# EAGLE design MOSFET Board (EAGLE 8.6.1)
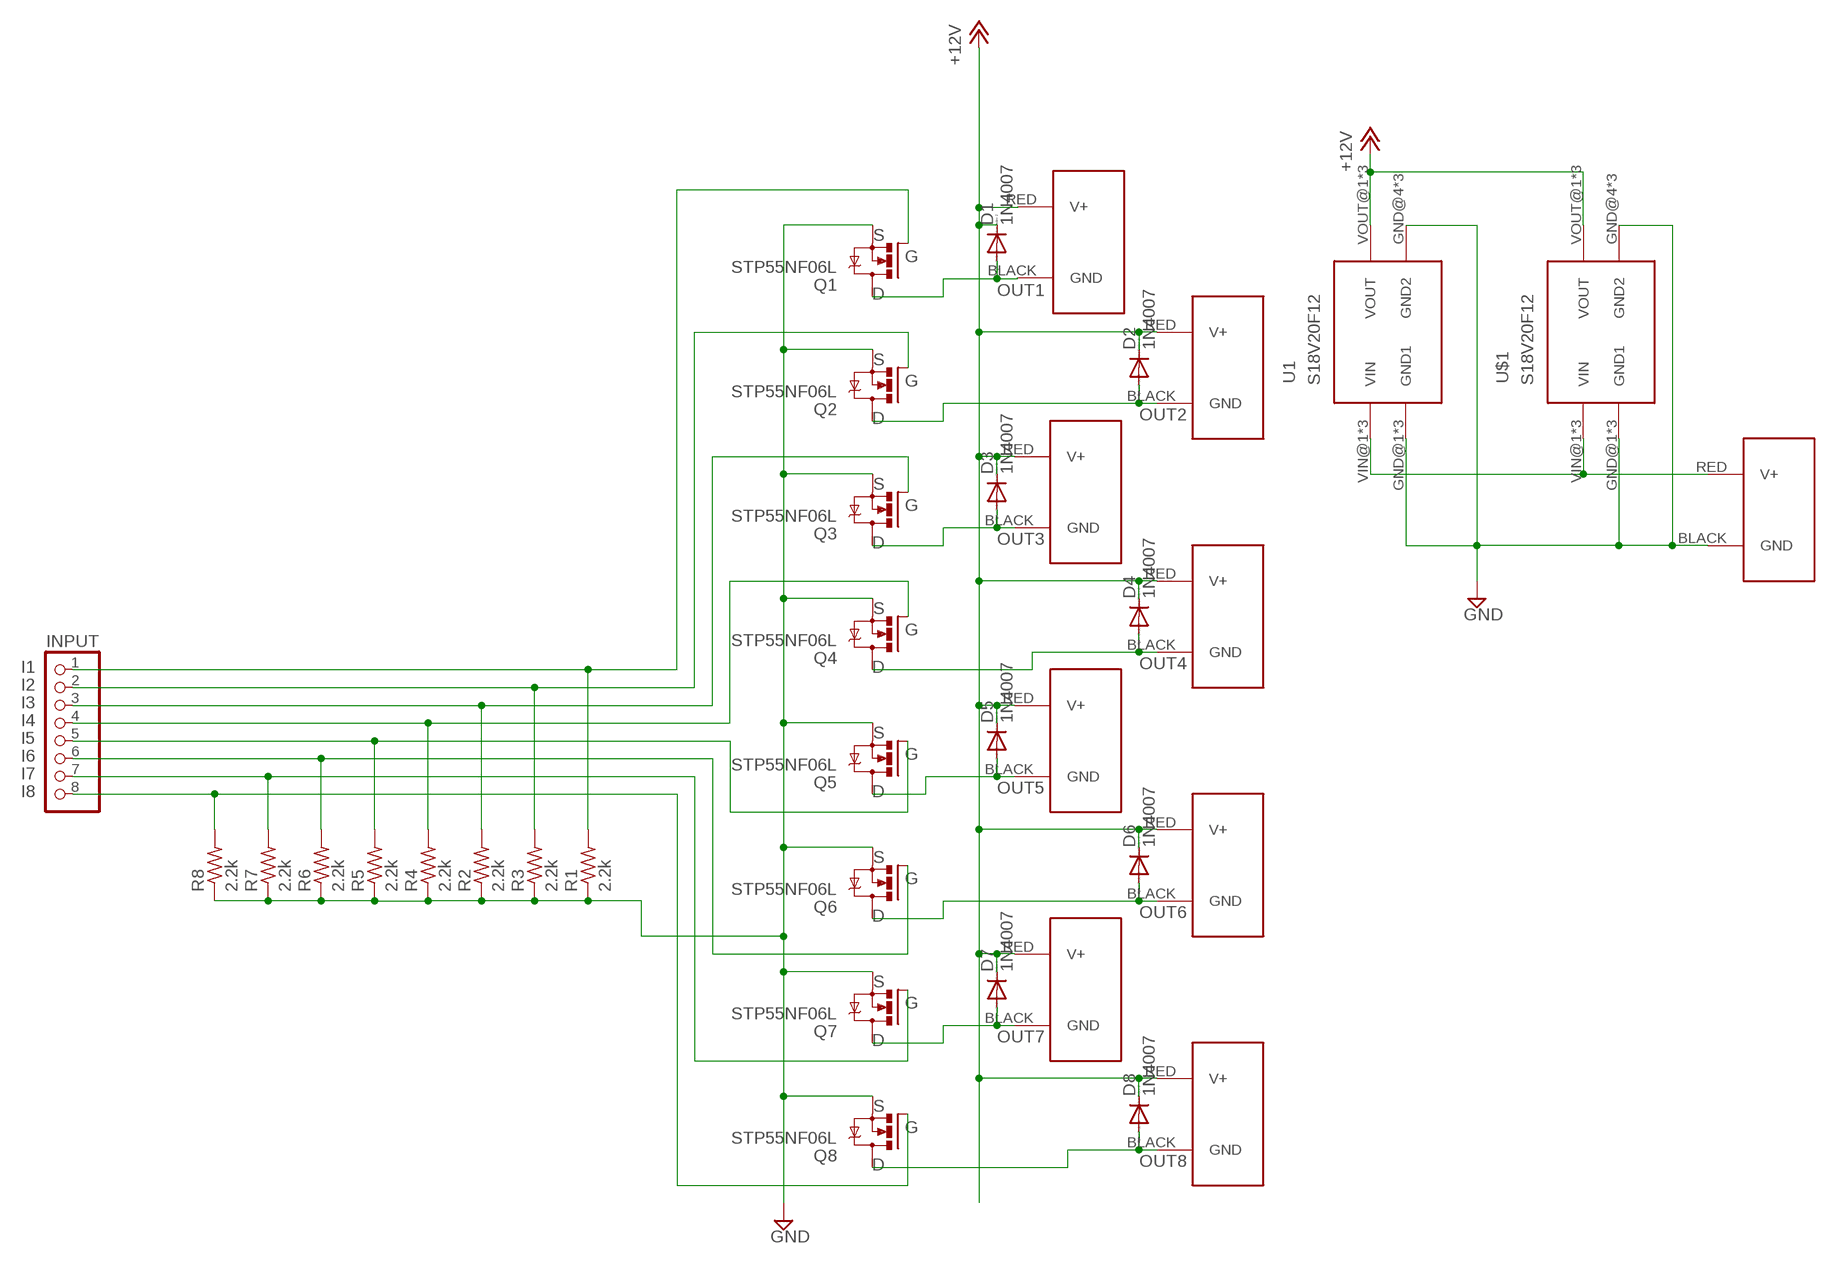
[diagram p0: schematic, sheet 1]

## Parts
D1  1N4007  [DO41-10]
D2  1N4007  [DO41-10]
D3  1N4007  [DO41-10]
D4  1N4007  [DO41-10]
D5  1N4007  [DO41-10]
D6  1N4007  [DO41-10]
D7  1N4007  [DO41-10]
D8  1N4007  [DO41-10]
INPUT  PINHD-1X8  [1X08]
J1  POWERPOLE_POWER25A  [POWERPOLE_PAIR_25A]
J2  POWERPOLE_POWER25A  [POWERPOLE_PAIR_25A]
J3  POWERPOLE_POWER25A  [POWERPOLE_PAIR_25A]
J4  POWERPOLE_POWER25A  [POWERPOLE_PAIR_25A]
J5  POWERPOLE_POWER25A  [POWERPOLE_PAIR_25A]
J6  POWERPOLE_POWER25A  [POWERPOLE_PAIR_25A]
J7  POWERPOLE_POWER25A  [POWERPOLE_PAIR_25A]
J8  POWERPOLE_POWER25A  [POWERPOLE_PAIR_25A]
J9  POWERPOLE_POWER25A  [POWERPOLE_PAIR_25A]
Q1  STP55NF06L  [TO220-3]
Q2  STP55NF06L  [TO220-3]
Q3  STP55NF06L  [TO220-3]
Q4  STP55NF06L  [TO220-3]
Q5  STP55NF06L  [TO220-3]
Q6  STP55NF06L  [TO220-3]
Q7  STP55NF06L  [TO220-3]
Q8  STP55NF06L  [TO220-3]
R1  2.2k  R-US_0207/10  [0207/10]
R2  2.2k  R-US_0207/10  [0207/10]
R3  2.2k  R-US_0207/10  [0207/10]
R4  2.2k  R-US_0207/10  [0207/10]
R5  2.2k  R-US_0207/10  [0207/10]
R6  2.2k  R-US_0207/10  [0207/10]
R7  2.2k  R-US_0207/10  [0207/10]
R8  2.2k  R-US_0207/10  [0207/10]
U1  S18V20F12  [S18V20]
U$1  S18V20F12  [S18V20]

## Nets
+12V: D1.C D2.C D3.C D4.C D5.C D6.C D7.C D8.C J2.RED(V+) J3.RED(V+) J4.RED(V+) J5.RED(V+) J6.RED(V+) J7.RED(V+) J8.RED(V+) J9.RED(V+) U1.VOUT@1(VOUT) U1.VOUT@2(VOUT) U1.VOUT@3(VOUT) U$1.VOUT@1(VOUT) U$1.VOUT@2(VOUT) U$1.VOUT@3(VOUT)
GND: J1.BLACK(GND) Q1.S Q2.S Q3.S Q4.S Q5.S Q6.S Q7.S Q8.S R1.1 R2.1 R3.1 R4.1 R5.1 R6.1 R7.1 R8.1 U1.GND@1(GND1) U1.GND@2(GND1) U1.GND@3(GND1) U1.GND@4(GND2) U1.GND@5(GND2) U1.GND@6(GND2) U$1.GND@1(GND1) U$1.GND@2(GND1) U$1.GND@3(GND1) U$1.GND@4(GND2) U$1.GND@5(GND2) U$1.GND@6(GND2)
I1: INPUT.1 Q1.G R1.2
I2: INPUT.2 Q2.G R3.2
I3: INPUT.3 Q3.G R2.2
I4: INPUT.4 Q4.G R4.2
I5: INPUT.5 Q5.G R5.2
I6: INPUT.6 Q6.G R6.2
I7: INPUT.7 Q7.G R7.2
I8: INPUT.8 Q8.G R8.2
OUT1: D1.A J2.BLACK(GND) Q1.D
OUT2: D2.A J3.BLACK(GND) Q2.D
OUT3: D3.A J4.BLACK(GND) Q3.D
OUT4: D4.A J5.BLACK(GND) Q4.D
OUT5: D5.A J6.BLACK(GND) Q5.D
OUT6: D6.A J7.BLACK(GND) Q6.D
OUT7: D7.A J8.BLACK(GND) Q7.D
OUT8: D8.A J9.BLACK(GND) Q8.D
VIN: J1.RED(V+) U1.VIN@1(VIN) U1.VIN@2(VIN) U1.VIN@3(VIN) U$1.VIN@1(VIN) U$1.VIN@2(VIN) U$1.VIN@3(VIN)

## Library data of the parts
D1-D8 = custom:1N4007: DIODE general purpose rectifier, 1 A
INPUT = pinhead:PINHD-1X8: PIN HEADER
J1-J9 = powerpoles:POWERPOLE_POWER: Anderson Powerpole Power Connector using ameteur radio standard layout
Q1-Q8 = custom:STP55NF06L: 60V 55A Power MOSFET
R1-R8 = resistor:R-US_: RESISTOR, American symbol
U1 U$1 = custom:S18V20F12: Polulu 12V@2A Boost/Buck Regulator

## Board
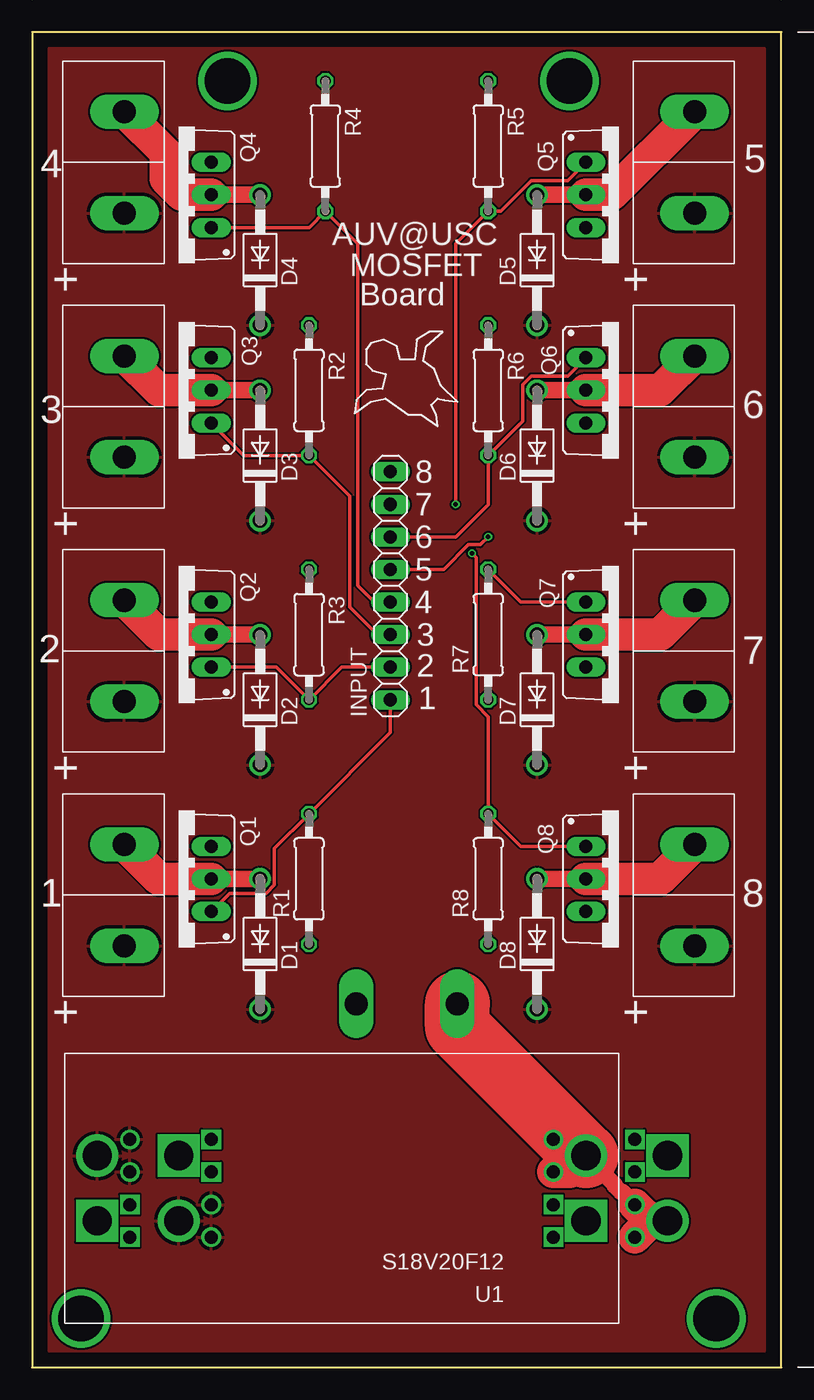
[diagram p1: board, top side]
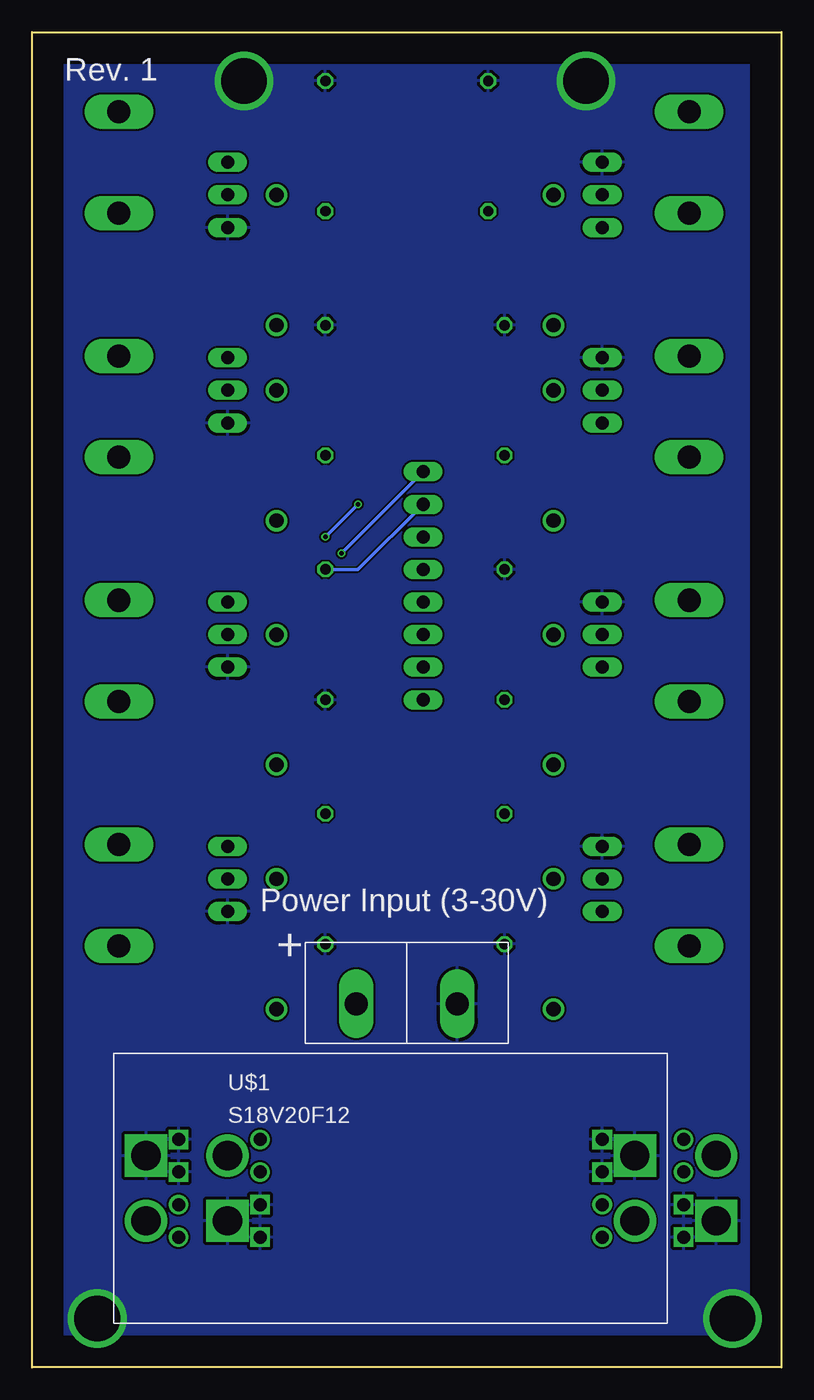
[diagram p2: board, bottom side, seen from below]

Size 58.42 x 104.14 mm. Coordinates in mm from the lower left corner, seen from the top.
Outline: 0,0 58.42,0 58.42,104.14 0,104.14 0,0
Copper layers (1*16): Top 0.035559375mm / dielectric 1.6mm / Bottom 0.035559375mm
Design rules "oshpark-2layer": minimum track width 6mil, minimum drill 10mil, track to track 6mil, track to pad 6mil, pad to pad 6mil, via to via 6mil, smd to smd 6mil, copper to edge 15mil, drill to drill 6mil, minimum pad ring 5mil, minimum via ring 5mil, stop-mask expansion 2.5mil, vias tented up to drill 0mil, thermal gap 10mil

### Footprints (pad centres in the part's own frame; a part is rotated, then mirrored left to right if it is on the bottom)
DO41-10 = drill 1.118: A 5.08,0; C -5.08,0
1X08 = drill 1.016 long: 1 -8.89,0; 2 -6.35,0; 3 -3.81,0; 4 -1.27,0; 5 1.27,0; 6 3.81,0; 7 6.35,0; 8 8.89,0
POWERPOLE_PAIR_25A = drill 1.8 long: BLACK 3.95,-0.85; RED -3.95,-0.85
TO220-3 = drill 1.016 long: D 0,-2.54; G -2.54,-2.54; S 2.54,-2.54
0207/10 = drill 0.813 octagon: 1 -5.08,0; 2 5.08,0
S18V20 = drill 2.286 square: GND@1 -19.05,2.54; GND@6 19.05,2.54 | drill 1.016 square: GND@2 -16.51,3.81; GND@3 -16.51,1.27; GND@4 16.51,3.81; GND@5 16.51,1.27 | drill 2.286: VIN@1 -19.05,-2.54; VOUT@1 19.05,-2.54 | drill 1.016: VIN@2 -16.51,-1.27; VIN@3 -16.51,-3.81; VOUT@2 16.51,-1.27; VOUT@3 16.51,-3.81

### Placement (x,y rotation side)
D1  17.78,33.02 90 top
D2  17.78,52.07 90 top
D3  17.78,71.12 90 top
D4  17.78,86.36 90 top
D5  39.37,86.36 90 top
D6  39.37,71.12 90 top
D7  39.37,52.07 90 top
D8  39.37,33.02 90 top
INPUT  27.94,60.96 90 top
J1  29.21,29.21 0 bottom
J2  6.35,36.83 90 top
J3  6.35,55.88 90 top
J4  6.35,74.93 90 top
J5  6.35,93.98 90 top
J6  50.8,93.98 90 top
J7  50.8,74.93 90 top
J8  50.8,55.88 90 top
J9  50.8,36.83 90 top
Q1  11.43,38.1 90 top
Q2  11.43,57.15 90 top
Q3  11.43,76.2 90 top
Q4  11.43,91.44 90 top
Q5  45.72,91.44 270 top
Q6  45.72,76.2 270 top
Q7  45.72,57.15 270 top
Q8  45.72,38.1 270 top
R1  21.59,38.1 90 top
R2  21.59,76.2 270 top
R3  21.59,57.15 270 top
R4  22.86,95.25 270 top
R5  35.56,95.25 270 top
R6  35.56,76.2 270 top
R7  35.56,57.15 90 top
R8  35.56,38.1 90 top
U1  24.13,13.97 180 top
U$1  30.48,13.97 0 bottom

### Tracks (layer width: path | path; a pad name or v marks a point on that pad's centre or on a via)
+12V
  pour Top: 1.27,102.87 1.27,1.27 57.15,1.27 57.15,102.87
GND  (via drill 3.56)
  other vias: 15.24,100.33 41.91,100.33 53.34,3.81 3.81,3.81
  pour Bottom: 2.54,101.6 2.54,2.54 55.88,2.54 55.88,101.6
I1
  Top 0.254: Q1.G 15.39,36.98 18.24,36.98 18.9,37.64 18.9,40.49 R1.2 27.94,49.53 INPUT.1
I2
  Top 0.254: INPUT.2 24.13,54.61 R3.2 19.05,54.61 Q2.G 12.7,54.61
I3
  Top 0.254: Q3.G 16.51,71.12 R2.2 24.77,67.94 24.77,59.31 26.92,57.15 INPUT.3 26.67,57.15
I4
  Top 0.254: Q4.G 21.59,88.9 R4.2 25.4,87.63 25.4,60.96 26.67,59.69 INPUT.4
I5  (via drill 0.35)
  Top 0.254: Q5.G 41.76,92.56 38.91,92.56 36.52,90.17 R5.2 33.02,87.63 v33.02,67.31 | v35.56,64.77 34.95,64.16 34.02,64.16 32.09,62.23 INPUT.5
  Bottom 0.254: v33.02,67.31 v35.56,64.77
I6
  Top 0.254: Q6.G 41.76,77.32 38.91,77.32 38.25,76.66 38.25,73.81 R6.2 35.56,67.31 33.02,64.77 INPUT.6
I7
  Top 0.254: Q7.G 38.1,59.69 R7.2
  Bottom 0.254: R7.2 33.02,62.23 INPUT.7
I8  (via drill 0.35)
  Top 0.254: Q8.G 38.1,40.64 R8.2 35.56,50.74 34.62,51.68 34.62,63.17 v34.29,63.5
  Bottom 0.254: v34.29,63.5 INPUT.8
OUT1
  Top 1.27: D1.A Q1.D
  Top 2.54: Q1.D 9.88,38.1 J2.BLACK
OUT2
  Top 1.27: D2.A Q2.D
  Top 2.54: Q2.D 9.88,57.15 J3.BLACK
OUT3
  Top 1.27: D3.A Q3.D
  Top 2.54: Q3.D 9.88,76.2 J4.BLACK
OUT4
  Top 1.27: D4.A Q4.D
  Top 2.54: J5.BLACK 10.41,94.72 10.41,92.71 11.68,91.44 Q4.D
OUT5
  Top 1.27: D5.A Q5.D
  Top 2.54: Q5.D 45.16,91.44 J6.BLACK
OUT6
  Top 1.27: Q6.D D6.A
  Top 2.54: J7.BLACK 48.97,76.2 Q6.D
OUT7
  Top 1.27: Q7.D D7.A
  Top 2.54: J8.BLACK 48.97,57.15 Q7.D
OUT8
  Top 1.27: Q8.D D8.A
  Top 2.54: J9.BLACK 48.97,38.1 Q8.D
VIN
  Top 1.27: U1.VIN@1 45.44,14.25 45.44,14.15 45.9,13.69 46,13.69 U$1.VIN@2
  Top 2.54: U1.VIN@2 41.8,15.24 arc45 41.98,15.31 U1.VIN@1 42.02,16.51 arc-45 41.84,16.58 U1.VIN@3 | 48.26,11.43 U$1.VIN@3 | U$1.VIN@1 48.26,11.43 | 48.26,11.43 U$1.VIN@2
  Top 5.08: U1.VIN@1 33.23,26.46 arc-45 33.16,26.63 J1.RED

### Text on the board
tPlace: 4 | 5 | AUV@USC | MOSFET | Board | 6 | 3 | 8 | 7 | 6 | 5 | 4 | 3 | 2 | 7 | 2 | 1 | 1 | 8
bPlace: Rev. 1 | Power Input (3-30V)